# Altium schematic sheet AtMega8-32 Programming Board.SchDoc
size A4
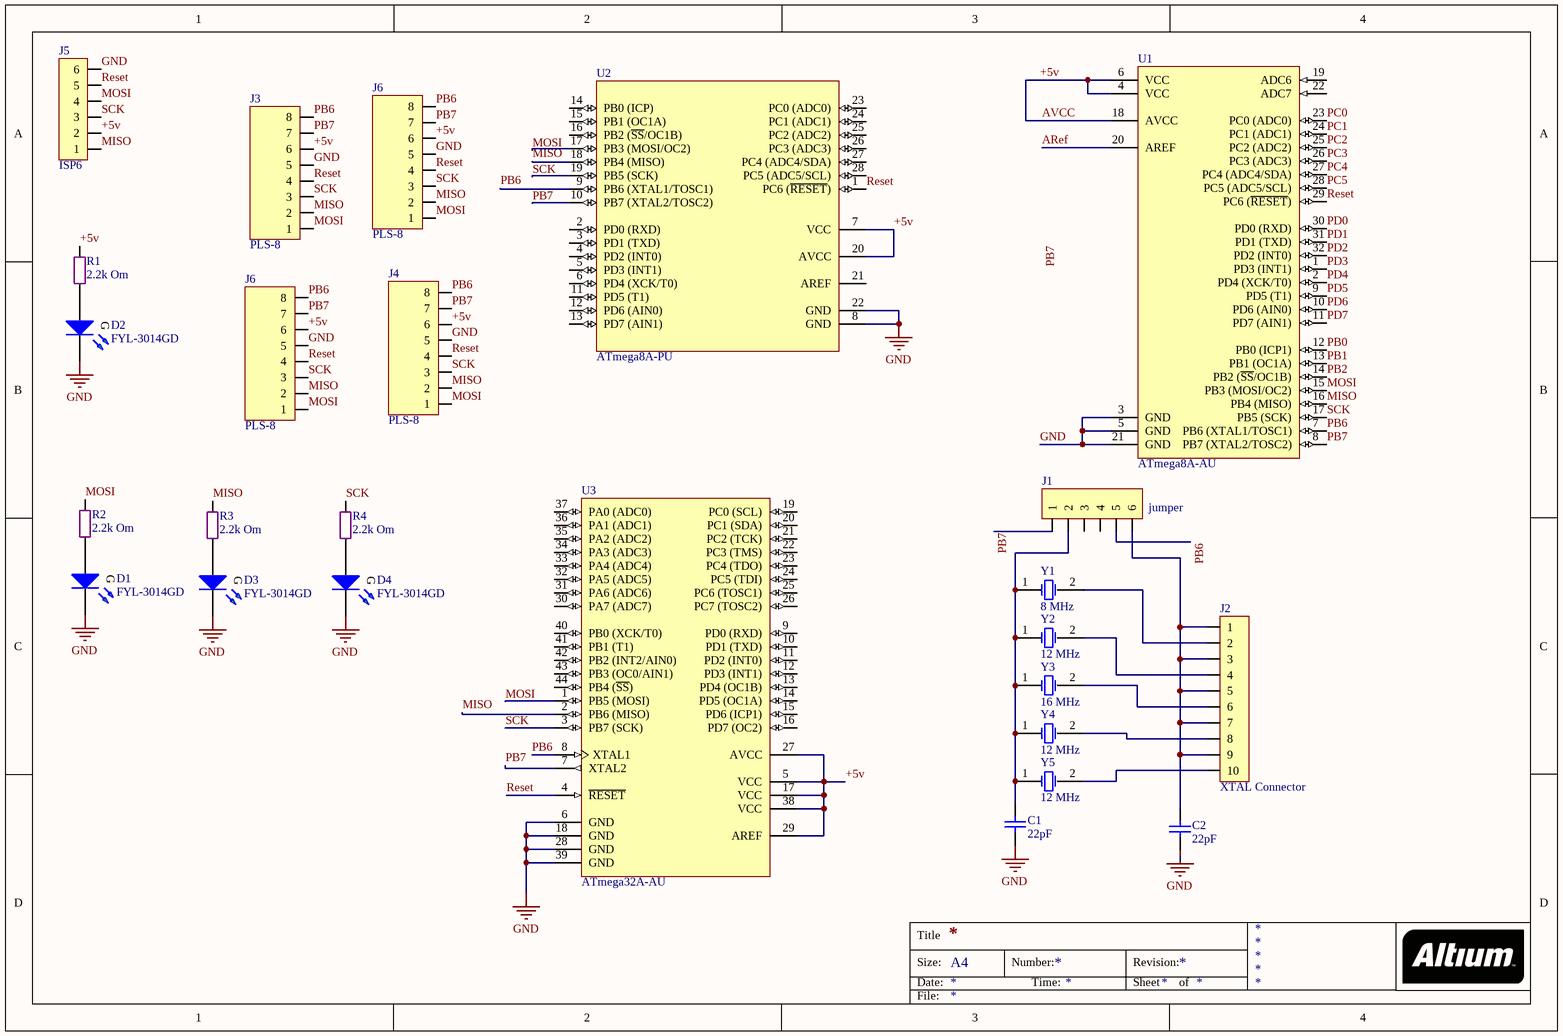
[diagram p0: AtMega8-32 Programming Board.SchDoc]

## Parts
(Parts that share a designator on the sheet are numbered #1, #2 ... from top to bottom, then left to right.)
C1  22pF  [SMD 0805 (2012)]
C2  22pF  [SMD 0805 (2012)]
D1  FYL-3014GD  [LED Round 3mm Green]
D2  FYL-3014GD  [LED Round 3mm Green]
D3  FYL-3014GD  [LED Round 3mm Green]
D4  FYL-3014GD  [LED Round 3mm Green]
J1  jumper  [LINE 2.54 x 6D (2 x 3)]
J2  XTAL Connector  [LINE 2.54 x 10D (2 x 5)]
J3  PLS-8  [Line 2.54 x 8]
J4  PLS-8  [Line 2.54 x 8]
J5  ISP6  [LINE 2.54 x 6D (2 x 3)]
J6#1  PLS-8  [Line 2.54 x 8]
J6#2  PLS-8  [Line 2.54 x 8]
R1  2.2k Om  [SMD 0805 (2012)]
R2  2.2k Om  [Res p7.62 (4p) 0.25w]
R3  2.2k Om  [Res p7.62 (4p) 0.25w]
R4  2.2k Om  [Res p7.62 (4p) 0.25w]
U1  ATmega8A-AU  [32A_M]
U2  ATmega8A-PU  [28P3]
U3  ATmega32A-AU  [44A_N]
Y1  8 MHz  [XTAL - 2]
Y2  12 MHz  [XTAL - 2]
Y3  16 MHz  [XTAL - 2]
Y4  12 MHz  [XTAL - 2]
Y5  12 MHz  [XTAL - 2]

## Nets
GND: C1.1 C2.1 D1.K D2.K D3.K D4.K J3.5 J4.5 J5.6 J6#1.5 J6#2.5 U1.3(GND) U1.5(GND) U1.21(GND) U2.8(GND) U2.22(GND) U3.6(GND) U3.18(GND) U3.28(GND) U3.39(GND)
+5v: J3.6 J4.6 J5.2 J6#1.6 J6#2.6 R1.1 U1.4(VCC) U1.6(VCC) U1.18(AVCC) U2.7(VCC) U2.20(AVCC) U3.5(VCC) U3.17(VCC) U3.27(AVCC) U3.29(AREF) U3.38(VCC)  [also labelled AVCC]
ARef: U1.20(AREF)
MISO: J3.2 J4.2 J5.1 J6#1.2 J6#2.2 R3.1 U1.16(PB4_(MISO)) U2.18(PB4_(MISO)) U3.2(PB6_(MISO))
MOSI: J3.1 J4.1 J5.4 J6#1.1 J6#2.1 R2.1 U1.15(PB3_(MOSI/OC2)) U2.17(PB3_(MOSI/OC2)) U3.1(PB5_(MOSI))
PB0: U1.12(PB0_(ICP1))
PB1: U1.13(PB1_(OC1A))
PB2: U1.14(PB2_(~{SS}/OC1B))
PB6: J1.5 J3.8 J4.8 J6#1.8 J6#2.8 U1.7(PB6_(XTAL1/TOSC1)) U2.9(PB6_(XTAL1/TOSC1)) U3.8(XTAL1)
PB7: J1.1 J3.7 J4.7 J6#1.7 J6#2.7 U1.8(PB7_(XTAL2/TOSC2)) U2.10(PB7_(XTAL2/TOSC2)) U3.7(XTAL2)
PC0: U1.23(PC0_(ADC0))
PC1: U1.24(PC1_(ADC1))
PC2: U1.25(PC2_(ADC2))
PC3: U1.26(PC3_(ADC3))
PC4: U1.27(PC4_(ADC4/SDA))
PC5: U1.28(PC5_(ADC5/SCL))
PD0: U1.30(PD0_(RXD))
PD1: U1.31(PD1_(TXD))
PD2: U1.32(PD2_(INT0))
PD3: U1.1(PD3_(INT1))
PD4: U1.2(PD4_(XCK/T0))
PD5: U1.9(PD5_(T1))
PD6: U1.10(PD6_(AIN0))
PD7: U1.11(PD7_(AIN1))
Reset: J3.4 J4.4 J5.5 J6#1.4 J6#2.4 U1.29(PC6_(~{RESET})) U2.1(PC6_(~{RESET})) U3.4(~{RESET})
SCK: J3.3 J4.3 J5.3 J6#1.3 J6#2.3 R4.1 U1.17(PB5_(SCK)) U2.19(PB5_(SCK)) U3.3(PB7_(SCK))
NetC1_2: C1.2 J1.2 Y1.1(OSC1) Y2.1(OSC1) Y3.1(OSC1) Y4.1(OSC1) Y5.1(OSC1)
NetC2_2: C2.2 J1.6 J2.1 J2.3 J2.5 J2.7 J2.9
NetD1_A: D1.A R2.2
NetD2_A: D2.A R1.2
NetD3_A: D3.A R3.2
NetD4_A: D4.A R4.2
NetJ2_2: J2.2 Y1.2(OSC2)
NetJ2_4: J2.4 Y2.2(OSC2)
NetJ2_6: J2.6 Y3.2(OSC2)
NetJ2_8: J2.8 Y4.2(OSC2)
NetJ2_10: J2.10 Y5.2(OSC2)

Not connected (* = marked no-connect by the designer): J1 3 4; U1 19(ADC6) 22(ADC7); U2 2(PD0_(RXD)) 3(PD1_(TXD)) 4(PD2_(INT0)) 5(PD3_(INT1)) 6(PD4_(XCK/T0)) 11(PD5_(T1)) 12(PD6_(AIN0)) 13(PD7_(AIN1)) 14(PB0_(ICP)) 15(PB1_(OC1A)) 16(PB2_(~{SS}/OC1B)) 21(AREF) 23(PC0_(ADC0)) 24(PC1_(ADC1)) 25(PC2_(ADC2)) 26(PC3_(ADC3)) 27(PC4_(ADC4/SDA)) 28(PC5_(ADC5/SCL)); U3 9(PD0_(RXD)) 10(PD1_(TXD)) 11(PD2_(INT0)) 12(PD3_(INT1)) 13(PD4_(OC1B)) 14(PD5_(OC1A)) 15(PD6_(ICP1)) 16(PD7_(OC2)) 19(PC0_(SCL)) 20(PC1_(SDA)) 21(PC2_(TCK)) 22(PC3_(TMS)) 23(PC4_(TDO)) 24(PC5_(TDI)) 25(PC6_(TOSC1)) 26(PC7_(TOSC2)) 30(PA7_(ADC7)) 31(PA6_(ADC6)) 32(PA5_(ADC5)) 33(PA4_(ADC4)) 34(PA3_(ADC3)) 35(PA2_(ADC2)) 36(PA1_(ADC1)) 37(PA0_(ADC0)) 40(PB0_(XCK/T0)) 41(PB1_(T1)) 42(PB2_(INT2/AIN0)) 43(PB3_(OC0/AIN1)) 44(PB4_(~{SS}))

## Notes on the sheet
- Labels drawn without touching a wire or pin: PB7
- Title
- Size:
- Date:
- A4
- Number:
- Time:
- Revision:
- Sheet
- of
- File:
- (in symbol Led Round 3mm Green) G

## Library data of the parts
C1 C2 = Cap SMD 0402-1812: Capacitor
D1-D4 = Led Round 3mm Green: 2.1v 10mA, 15-30mCd; Forward Voltage Max: 2.3; Forward Voltage TYP: 2.1; Wave len min/typ: 570nm; Liminous Typ (mcd): 15-30; Forward Amp (mA): 10; Color: Green; Name: FYL-3014GD
J1 J5 = PLD-6 (2 x 3): Vert, Dbl line, Male
J2 = PLD-10 (2 x 5): Vert, Dbl line, Male
J3 J4 J6#1 J6#2 = PLS-8: Vert, Sgl line, Male
R1-R4 = Res All Types
U1 = ATmega8A-AU: 8-bit AVR Microcontroller, 8KB Flash, 512 Bytes EEPROM, 1KB SRAM, 32-pin TQFP, Industrial Grade (-40°C to 85°C); Published: 1-Apr-2010; DatasheetVersion: revC, Jul-2009; PackageVersion: revB, Oct-2001; PackageReference: 32A; Publisher: Altium Limited; PackageDescription: 32-Lead, 7x7x1.0 mm Body, 0.8mm Lead Pitch, Thin Profile Plastic Quad Flat Package (TQFP); Supplier 1: Digi-Key; Supplier Part Number 1: ATMEGA8A-AU-ND; Supplier 2: Farnell; Supplier Part Number 2: 1748532; Supplier 3: Mouser; Supplier Part Number 3: 556-ATMEGA8A-AU; Code_JEDEC: MS-026-ABA; ComponentLink1Description: Manufacturer Link; ComponentLink1URL: http://www.atmel.com/products/avr/default.asp?; ComponentLink2Description: ATmega8A Datasheet; ComponentLink2URL: http://www.atmel.com/dyn/resources/prod_documents/doc8159.pdf; ComponentLink3Description: ATmega8A Summary; ComponentLink3URL: http://www.atmel.com/dyn/resources/prod_documents/8159S.pdf; ComponentLink4Description: Atmel.com Home; ComponentLink4URL: http://www.atmel.com
U2 = ATmega8A-PU: 8-bit AVR Microcontroller, 8KB Flash, 512 Bytes EEPROM, 1KB SRAM, 28-pin PDIP, Industrial Grade (-40°C to 85°C); Published: 1-Apr-2010; DatasheetVersion: revC, Jul-2009; PackageVersion: revB, Sep-2001; PackageReference: 28P3; Publisher: Altium Limited; PackageDescription: 28-lead (0.300"/7.62mm Wide) Plastic Dual Inline Package (PDIP); Supplier 1: Digi-Key; Supplier Part Number 1: ATMEGA8A-PU-ND; Supplier 2: Farnell; Supplier Part Number 2: 1748534; Supplier 3: Mouser; Supplier Part Number 3: 556-ATMEGA8A-PU; ComponentLink1Description: Manufacturer Link; ComponentLink1URL: http://www.atmel.com/products/avr/default.asp?; ComponentLink2Description: ATmega8A Datasheet; ComponentLink2URL: http://www.atmel.com/dyn/resources/prod_documents/doc8159.pdf; ComponentLink3Description: ATmega8A Summary; ComponentLink3URL: http://www.atmel.com/dyn/resources/prod_documents/8159S.pdf; ComponentLink4Description: Atmel.com Home; ComponentLink4URL: http://www.atmel.com
U3 = ATmega32A-AU: 8-bit AVR Microcontroller, 32KB Flash, 1KB EEPROM, 2KB SRAM, 44-pin TQFP, Industrial Grade (-40°C to 85°C); Published: 1-Apr-2010; DatasheetVersion: revB, Jul-2009; PackageVersion: rev.B, Oct-2001; PackageReference: 44A; Publisher: Altium Limited; PackageDescription: 44-Pin Plastic Thin Profile Quad Flat Pack, 10 x 10 x 1.0 mm Body, 0.8 mm Pitch (TQFP); Supplier 1: Digi-Key; Supplier Part Number 1: ATMEGA32A-AU-ND; Supplier 2: Farnell; Supplier Part Number 2: 1704563; Supplier 3: Mouser; Supplier Part Number 3: 556-ATMEGA32A-AU; ComponentLink1Description: Manufacturer Link; ComponentLink1URL: http://www.atmel.com/products/avr/default.asp?; ComponentLink2Description: ATmega32A Datasheet; ComponentLink2URL: http://www.atmel.com/dyn/resources/prod_documents/doc8155.pdf; ComponentLink3Description: ATmega32A Summary; ComponentLink3URL: http://www.atmel.com/dyn/resources/prod_documents/8155S.pdf; ComponentLink4Description: Atmel.com Home; ComponentLink4URL: http://www.atmel.com
Y1-Y5 = XTAL: Crystal Oscillator; Published: 8-Jun-2000; LatestRevisionDate: 17-Jul-2002; LatestRevisionNote: Re-released for DXP Platform.; PackageReference: R38; Publisher: Altium Limited; PackageDescription: Crystal, Thru-Hole; 2 Leads; Body 3.1 x 8.2 mm (Dia.xH)